# EAGLE design Transmitter (EAGLE 8.0.0)
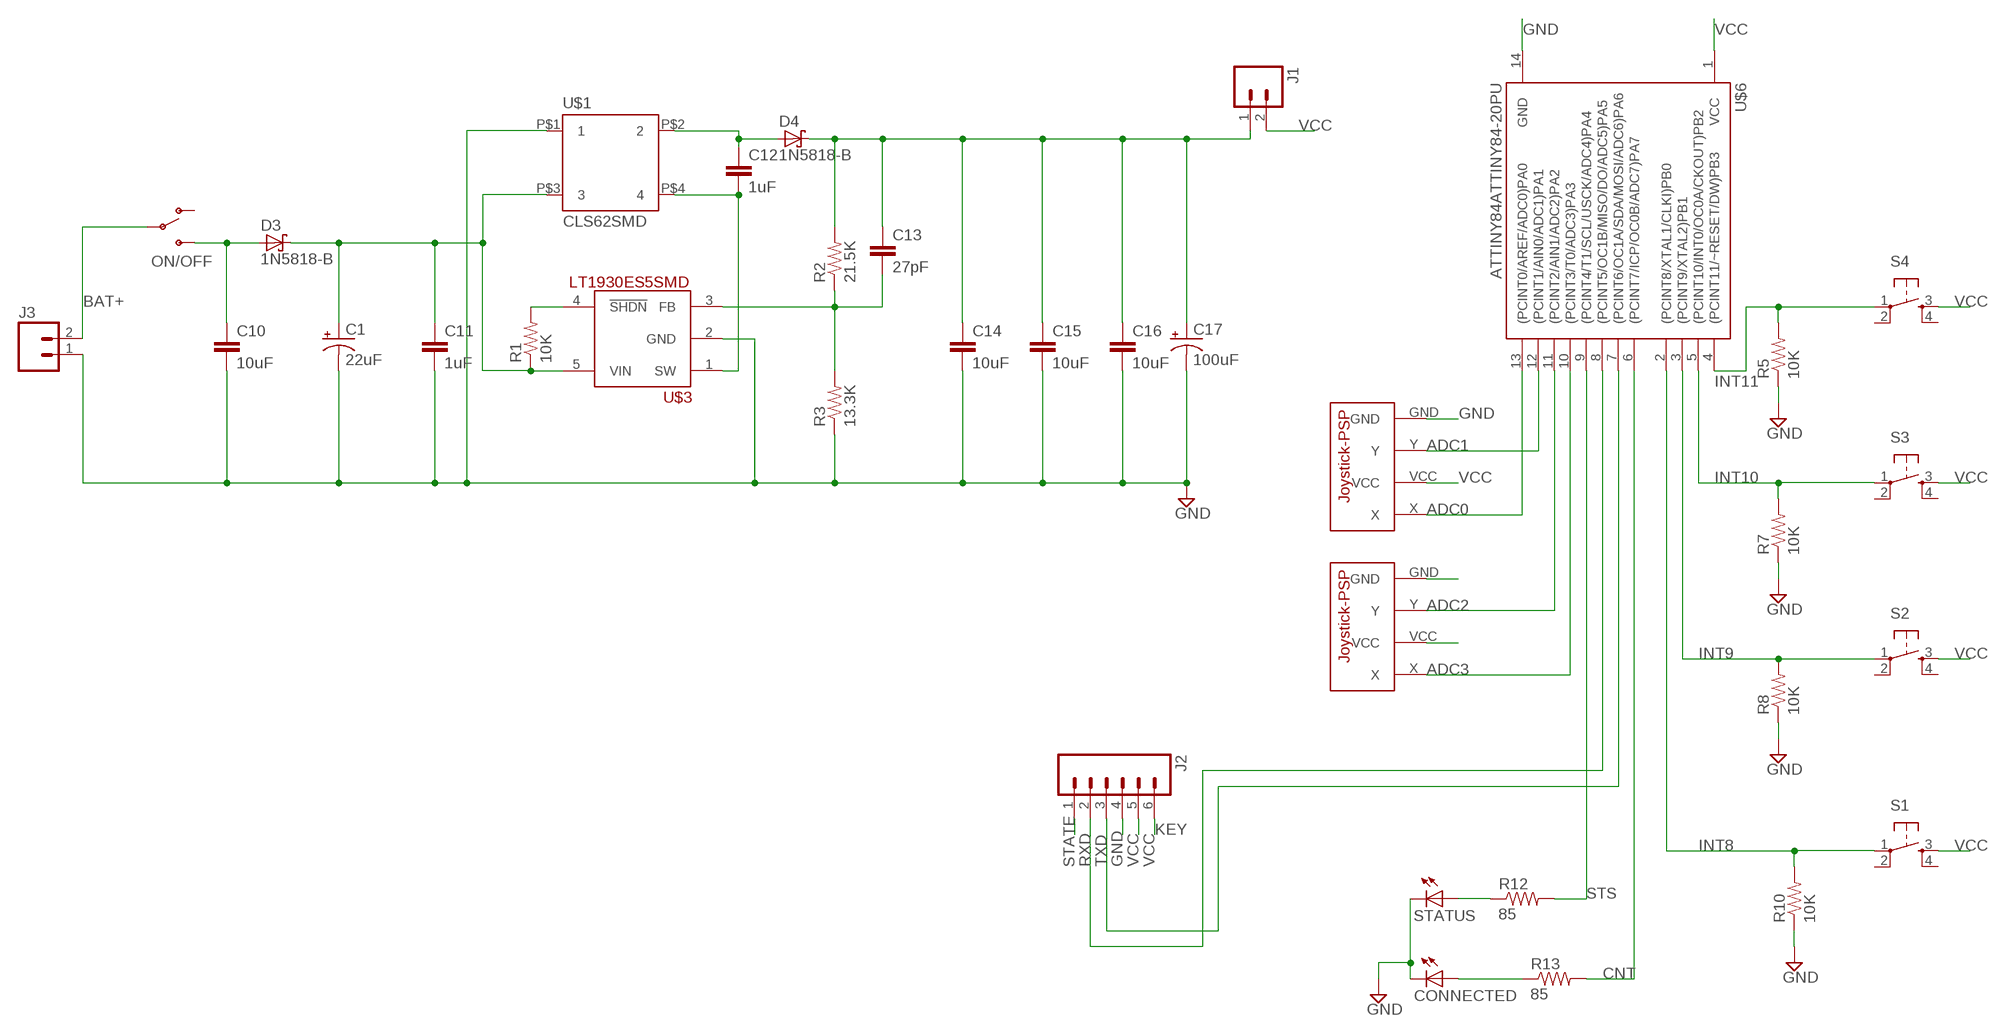
[diagram p0: schematic, sheet 1]

## Parts
C1  22uF  CAP_POLPTH2  [CPOL-RADIAL-10UF-25V]
C10  10uF  CAPEZ  [CAP-PTH-SMALLEZ]
C11  1uF  CAPEZ  [CAP-PTH-SMALLEZ]
C12  1uF  CAPEZ  [CAP-PTH-SMALLEZ]
C13  27pF  CAPEZ  [CAP-PTH-SMALLEZ]
C14  10uF  CAPEZ  [CAP-PTH-SMALLEZ]
C15  10uF  CAPEZ  [CAP-PTH-SMALLEZ]
C16  10uF  CAPEZ  [CAP-PTH-SMALLEZ]
C17  100uF  CAP_POLPTH2  [CPOL-RADIAL-10UF-25V]
CONNECTED  LED5MM  [LED5MM]
D3  1N5818-B  [DO41-7.6]
D4  1N5818-B  [DO41-7.6]
J1  M02PTH  [1X02]
J2  M06NO_SILK_FEMALE_PTH  [1X06_NO_SILK]
J3  M021X02_NO_SILK  [1X02_NO_SILK]
ON/OFF  SWITCH-SPDTKIT  [SWITCH-SPDT_KIT]
R1  10K  RESISTORPTH-1/4W  [AXIAL-0.4]
R2  21.5K  RESISTORPTH-1/4W  [AXIAL-0.4]
R3  13.3K  RESISTORPTH-1/4W  [AXIAL-0.4]
R5  10K  RESISTORPTH-1/4W  [AXIAL-0.4]
R7  10K  RESISTORPTH-1/4W  [AXIAL-0.4]
R8  10K  RESISTORPTH-1/4W  [AXIAL-0.4]
R10  10K  RESISTORPTH-1/4W  [AXIAL-0.4]
R12  85  RESISTORPTH-1/4W  [AXIAL-0.4]
R13  85  RESISTORPTH-1/4W  [AXIAL-0.4]
S1  TAC_SWITCHPTH  [TACTILE-PTH]
S2  TAC_SWITCHPTH  [TACTILE-PTH]
S3  TAC_SWITCHPTH  [TACTILE-PTH]
S4  TAC_SWITCHPTH  [TACTILE-PTH]
STATUS  LED5MM  [LED5MM]
U$1  CLS62SMD  [CLS62]
U$2  JOYSTICK-PSP1000  [JOYSTICK-PSP1000]
U$3  LT1930ES5SMD  [LT1930ES5]
U$5  JOYSTICK-PSP1000  [JOYSTICK-PSP1000]
U$6  ATTINY84ATTINY84-20PU  [DIL14]

## Nets
ADC0: U$2.X U$6.13((PCINT0/AREF/ADC0)PA0)
ADC1: U$2.Y U$6.12((PCINT1/AIN0/ADC1)PA1)
ADC2: U$5.Y U$6.11((PCINT2/AIN1/ADC2)PA2)
ADC3: U$5.X U$6.10((PCINT3/T0/ADC3)PA3)
BAT+: J3.2 ON/OFF.2(P)
CNT: R13.P$2 U$6.6((PCINT7/ICP/OC0B/ADC7)PA7)
GND: C1.2(-) C10.2 C11.2 C14.2 C15.2 C16.2 C17.2(-) CONNECTED.K(C) J2.4 J3.1 R3.P$1 R5.P$1 R7.P$1 R8.P$1 R10.P$1 STATUS.K(C) U$1.P$1 U$2.GND U$3.2(GND) U$5.GND U$6.14(GND)
INT8: R10.P$2 S1.1 U$6.2((PCINT8/XTAL1/CLKI)PB0)
INT9: R8.P$2 S2.1 U$6.3((PCINT9/XTAL2)PB1)
INT10: R7.P$2 S3.1 U$6.5((PCINT10/INT0/OC0A/CKOUT)PB2)
INT11: R5.P$2 S4.1 U$6.4((PCINT11/~RESET/DW)PB3)
N$9: C10.1 D3.A ON/OFF.3(S)
N$10: C1.1(+) C11.1 D3.C R1.P$1 U$1.P$3 U$3.5(VIN)
N$12: C12.1 D4.A U$1.P$2
N$13: C12.2 U$1.P$4 U$3.1(SW)
N$14: R1.P$2 U$3.4(!SHDN)
N$15: C13.2 R2.P$1 R3.P$2 U$3.3(FB)
N$17: C13.1 C14.1 C15.1 C16.1 C17.1(+) D4.C J1.1 R2.P$2
N$24: R12.P$1 STATUS.A
N$25: CONNECTED.A R13.P$1
RXD: J2.2 U$6.8((PCINT5/OC1B/MISO/DO/ADC5)PA5)
STATE: J2.1
STS: R12.P$2 U$6.9((PCINT4/T1/SCL/USCK/ADC4)PA4)
TXD: J2.3 U$6.7((PCINT6/OC1A/SDA/MOSI/ADC6)PA6)
VCC: J1.2 J2.5 J2.6 S1.3 S2.3 S3.3 S4.3 U$2.VCC U$5.VCC U$6.1(VCC)
Unconnected: ON/OFF.1(O) S1.2 S1.4 S2.2 S2.4 S3.2 S3.4 S4.2 S4.4

## Notes on the sheet
- KEY

## Library data of the parts
C1 = SparkFun-Passives:CAP_POL: Capacitor Polarized These are standard SMD and PTH capacitors. Normally 10uF, 47uF, and 100uF in electrolytic and tantalum varieties. Always verify the external diameter of the through hole cap, it varies with capacity, voltage, and manufacturer. The EIA devices should be standard.; MF: FARNELL; MPN: MKS2B042201F00KSSD; OC_NEWARK: 10WX4288
C10-C16 = SparkFun-Passives:CAP: Capacitor Standard 0603 ceramic capacitor, and 0.1" leaded capacitor.; OC_NEWARK: unknown
C17 = SparkFun-Passives:CAP_POL: Capacitor Polarized These are standard SMD and PTH capacitors. Normally 10uF, 47uF, and 100uF in electrolytic and tantalum varieties. Always verify the external diameter of the through hole cap, it varies with capacity, voltage, and manufacturer. The EIA devices should be standard.; OC_NEWARK: unknown
CONNECTED STATUS = led:LED: LED OSRAM: - CHIPLED LG R971, LG N971, LY N971, LG Q971, LY Q971, LO R971, LY R971 LH N974, LH R974 LS Q976, LO Q976, LY Q976 LO Q996 - Hyper CHIPLED LW Q18S LB Q993, LB Q99A, LB R99A - SideLED LS A670, LO A670, LY A670, LG A670, LP A670 LB A673, LV A673, LT A673, LW A673 LH A674 LY A675 LS A676, LA A676, LO A676, LY A676, LW A676 LS A679, LY A679, LG A679 - Hyper Micro SIDELED® LS Y876, LA Y876, LO Y876, LY Y876 LT Y87S - SmartLED LW L88C, LW L88S LB L89C, LB L89S, LG L890 LS L89K, LO L89K, LY L89K LS L896, LA L896, LO L896, LY L896 - TOPLED LS T670, LO T670, LY T670, LG T670, LP T670 LSG T670, LSP T670, LSY T670, LOP T670, LYG T670 LG T671, LOG T671, LSG T671 LB T673, LV T673, LT T673, LW T673 LH T674 LS T676, LA T676, LO T676, LY T676, LB T676, LH T676, LSB T676, LW T676 LB T67C, LV T67C, LT T67C, LS T67K, LO T67K, LY T67K, LW E67C LS E67B, LA E67B, LO E67B, LY E67B, LB E67C, LV E67C, LT E67C LW T67C LS T679, LY T679, LG T679 LS T770, LO T770, LY T770, LG T770, LP T770 LB T773, LV T773, LT T773, LW T773 LH T774 LS E675, LA E675, LY E675, LS T675 LS T776, LA T776, LO T776, LY T776, LB T776 LHGB T686 LT T68C, LB T68C - Hyper Mini TOPLED® LB M676 - Mini TOPLED Santana® LG M470 LS M47K, LO M47K, LY M47K Source: http://www.osram.convergy.de LUXEON: - LUMILED® LXK2-PW12-R00, LXK2-PW12-S00, LXK2-PW14-U00, LXK2-PW14-V00 LXK2-PM12-R00, LXK2-PM12-S00, LXK2-PM14-U00 LXK2-PE12-Q00, LXK2-PE12-R00, LXK2-PE12-S00, LXK2-PE14-T00, LXK2-PE14-U00 LXK2-PB12-K00, LXK2-PB12-L00, LXK2-PB12-M00, LXK2-PB14-N00, LXK2-PB14-P00, LXK2-PB14-Q00 LXK2-PR12-L00, LXK2-PR12-M00, LXK2-PR14-Q00, LXK2-PR14-R00 LXK2-PD12-Q00, LXK2-PD12-R00, LXK2-PD12-S00 LXK2-PH12-R00, LXK2-PH12-S00 LXK2-PL12-P00, LXK2-PL12-Q00, LXK2-PL12-R00 Source: www.luxeon.com KINGBRIGHT: KA-3528ASYC Source: www.kingbright.com; OC_NEWARK: unknown
D3 D4 = diode:1N581*: 1.0A SCHOTTKY BARRIER RECTIFIER Source: http://www.diodes.com/datasheets/ds23001.pdf; OC_NEWARK: unknown
J1 J3 = SparkFun-Connectors:M02: Standard 2-pin 0.1" header. Use with - straight break away headers ( PRT-00116) - right angle break away headers (PRT-00553) - swiss pins (PRT-00743) - machine pins (PRT-00117) - female headers (PRT-00115) Molex polarized connector foot print use with: PRT-08233 with associated crimp pins and housings. 2.54_SCREWTERM for use with PRT-10571. 3.5mm Screw Terminal footprints for PRT-08084 5mm Screw Terminal footprints for use with PRT-08432; OC_NEWARK: unknown
J2 = SparkFun-Connectors:M06: Header 6 Standard 6-pin 0.1" header. Use with straight break away headers (SKU : PRT-00116), right angle break away headers (PRT-00553), swiss pins (PRT-00743), machine pins (PRT-00117), and female headers (PRT-00115). Molex polarized connector foot print use with SKU : PRT-08094 with associated crimp pins and housings. NOTES ON THE VARIANTS LOCK and LOCK_LONGPADS... This footprint was designed to help hold the alignment of a through-hole component (i.e. 6-pin header) while soldering it into place. You may notice that each hole has been shifted either up or down by 0.005 of an inch from it's more standard position (which is a perfectly straight line). This slight alteration caused the pins (the squares in the middle) to touch the edges of the holes. Because they are alternating, it causes a "brace" to hold the component in place. 0.005 has proven to be the perfect amount of "off-center" position when using our standard breakaway headers. Although looks a little odd when you look at the bare footprint, once you have a header in there, the alteration is very hard to notice. Also,if you push a header all the way into place, it is covered up entirely on the bottom side. This idea of altering the position of holes to aid alignment will be further integrated into the Sparkfun Library for other footprints. It can help hold any component with 3 or more connection pins.; OC_NEWARK: unknown; PROD_ID: CONN-08437
ON/OFF = SparkFun-Electromechanical:SWITCH-SPDT: SPDT Switch Simple slide switch, Spark Fun Electronics SKU : COM-00102 DPDT SMT slide switch, AYZ0202, SWCH-08179; OC_NEWARK: unknown; PROD_ID: SWCH-08261
R1-R3 = SparkFun-Resistors:RESISTOR: Resistor Basic schematic elements and footprints for 0603, 1206, and PTH resistors.; OC_NEWARK: unknown
R5 R7 R8 R10 R12 R13 = SparkFun-Passives:RESISTOR: Resistor Basic schematic elements and footprints for 0603, 1206, and PTH resistors.; OC_NEWARK: unknown
S1-S4 = SparkFun-Retired:TAC_SWITCH: Momentary Switch Button commonly used for reset or general input. Spark Fun Electronics SKU : COM-00097 SMT- SWCH-08247; OC_NEWARK: unknown
U$1 = Custom:CLS62; OC_NEWARK: unknown
U$2 U$5 = SparkFun-Electromechanical:JOYSTICK-PSP1000: This is a footprint for the PSP-1000 Joystick. 4-pins: X, Y, Vcc and GND; OC_NEWARK: unknown
U$3 = linear:LT1930ES5; OC_NEWARK: unknown
U$6 = SparkFun-DigitalIC:ATTINY84: Atmel 14-pin 2/4/8kB flash uC; OC_NEWARK: unknown

## Board
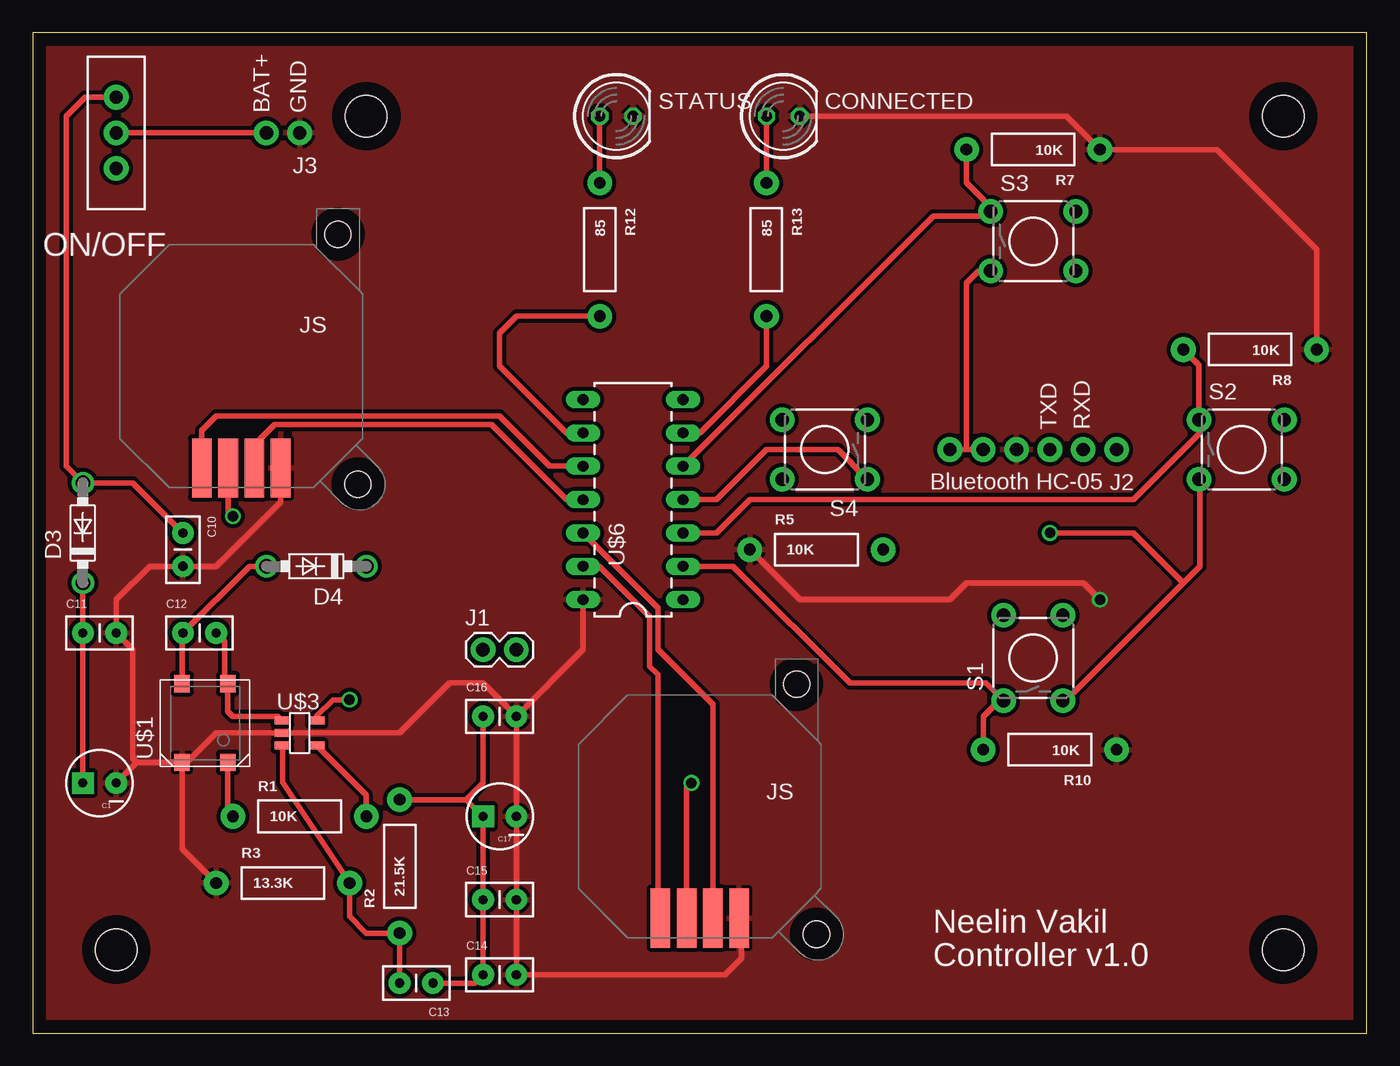
[diagram p1: board, top side]
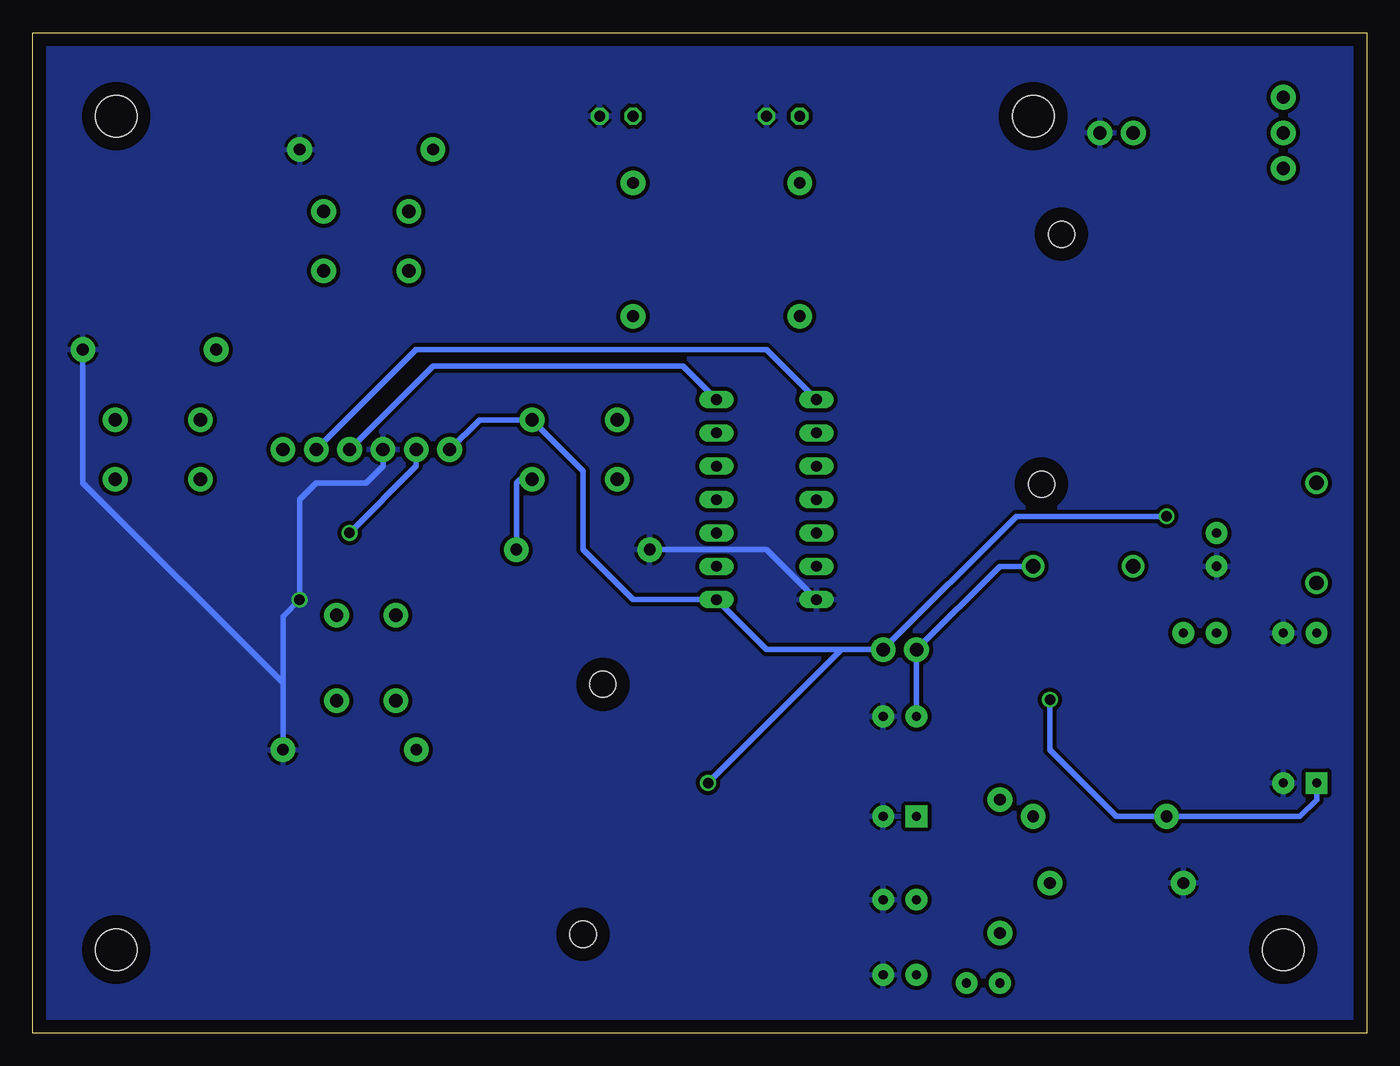
[diagram p2: board, bottom side, seen from below]

Size 101.6 x 76.2 mm. Coordinates in mm from the lower left corner, seen from the top.
Outline: 0,0 101.6,0 101.6,76.2 0,76.2 0,0
Copper layers (1*16): Top 0.035mm / dielectric 1.5mm / Bottom 0.035mm
Design rules "default": minimum track width 10mil, minimum drill 24mil, track to track 8mil, track to pad 8mil, pad to pad 8mil, via to via 8mil, smd to smd 8mil, copper to edge 40mil, drill to drill 8mil, minimum pad ring 10mil, minimum via ring 8mil, stop-mask expansion 4mil, vias tented up to drill 0mil, thermal gap 10mil
Holes 3.17 mm at 95.25,69.85 95.25,6.35 6.35,6.35 25.4,69.85

### Footprints (pad centres in the part's own frame; a part is rotated, then mirrored left to right if it is on the bottom)
CPOL-RADIAL-10UF-25V = drill 0.7 pad 1.651 square: 1 1.27,0 | drill 0.7 pad 1.651: 2 -1.27,0
CAP-PTH-SMALLEZ = drill 0.7 pad 1.651: 1 0,0; 2 2.54,0
LED5MM = drill 0.813 octagon: A -1.27,0; K 1.27,0
DO41-7.6 = drill 1.1 pad 1.7: A 3.81,0; C -3.81,0
1X02 = drill 1.016 pad 1.88: 1 0,0; 2 2.54,0
1X06_NO_SILK = drill 1.016 pad 1.88: 1 0,0; 2 2.54,0; 3 5.08,0; 4 7.62,0; 5 10.16,0; 6 12.7,0
1X02_NO_SILK = drill 1.016 pad 1.88: 1 0,0; 2 2.54,0
SWITCH-SPDT_KIT = drill 1.016 pad 1.88: 1 0,2.718; 2 0,0; 3 0,-2.718
AXIAL-0.4 = drill 0.9 pad 1.88: P$1 -5.08,0; P$2 5.08,0
TACTILE-PTH = drill 1.016 pad 1.88: 1 -3.251,2.261; 2 3.251,2.261; 3 -3.251,-2.261; 4 3.251,-2.261
CLS62 = smd 1.3 x 1.2: P$1 0.3,5.15; P$2 6.3,5.15; P$3 0.3,1.65; P$4 6.3,1.65
JOYSTICK-PSP1000 = smd 1.5 x 4.5: GND -3,7.75; VCC 1,7.75; X 3,7.75; Y -1,7.75 | hole 2: -8.89,8.985; -7.375,-10.06
LT1930ES5 = smd 0.6 x 1.2: 1 -0.95,-1.306; 2 0,-1.306; 3 0.95,-1.306; 4 0.95,1.306; 5 -0.95,1.306
DIL14 = drill 0.813 long: 1 -8.89,-3.81; 2 -6.35,-3.81; 3 -3.81,-3.81; 4 -1.27,-3.81; 5 1.27,-3.81; 6 3.81,-3.81; 7 6.35,-3.81; 8 6.35,3.81; 9 3.81,3.81; 10 1.27,3.81; 11 -1.27,3.81; 12 -3.81,3.81; 13 -6.35,3.81; 14 -8.89,3.81

### Placement (x,y rotation side)
C1  5.08,19.05 180 top
C10  11.43,38.1 270 top
C11  3.81,30.48 0 top
C12  11.43,30.48 0 top
C13  30.48,3.81 180 top
C14  34.29,4.45 0 top
C15  34.29,10.16 0 top
C16  34.29,24.13 0 top
C17  35.56,16.51 180 top
CONNECTED  57.15,69.85 0 top
D3  3.81,38.1 90 top
D4  21.59,35.56 180 top
J1  34.29,29.21 0 top
J2  82.55,44.45 180 top
J3  20.32,68.58 180 top
ON/OFF  6.35,68.58 180 top
R1  20.32,16.51 0 top
R2  27.94,12.7 90 top
R3  19.05,11.43 0 top
R5  59.69,36.83 0 top
R7  76.2,67.31 180 top
R8  92.71,52.07 180 top
R10  77.47,21.59 180 top
R12  43.18,59.69 270 top
R13  55.88,59.69 270 top
S1  76.2,28.57 90 top
S2  92.08,44.45 0 top
S3  76.2,60.33 0 top
S4  60.33,44.45 180 top
STATUS  44.45,69.85 0 top
U$1  16.51,20.32 90 top
U$2  50.8,16.51 180 top
U$3  20.32,22.86 270 top
U$5  15.88,50.8 180 top
U$6  45.72,41.91 90 top

### Tracks (layer width: path | path; a pad name or v marks a point on that pad's centre or on a via)
ADC0
  Top 0.406: U$6.13 43.18,35.56 46.99,31.75 46.99,27.94 47.62,27.3 47.62,8.94 U$2.X
ADC1
  Top 0.406: U$2.Y 51.8,25.04 47.62,29.21 47.62,32.38 U$6.12
ADC2
  Top 0.406: U$6.11 40.64,40.64 34.92,46.35 18.41,46.35 16.51,44.45 16.51,43.41 U$5.Y
ADC3
  Top 0.406: U$5.X 12.88,45.9 13.97,46.99 35.56,46.99 39.37,43.18 U$6.10
BAT+
  Top 0.406: ON/OFF.2 J3.2
CNT
  Top 0.406: U$6.6 50.8,45.72 55.88,50.8 R13.P$2
GND  (via drill 0.8)
  Top 0.406: CONNECTED.K 78.74,69.85 R7.P$1 90.17,67.31 97.79,59.69 R8.P$1 | C16.2 C17.2 C15.2 C14.2 52.7,4.45 53.98,5.71 53.98,8.59 U$2.GND | C16.2 41.91,29.21 U$6.14 | U$1.P$1 11.73,20.62 13.97,22.86 U$3.2 27.94,22.86 31.75,26.67 34.29,26.67 C16.2 | U$1.P$1 11.36,14.04 R3.P$1 | 7.92,20.62 U$1.P$1 | 7.92,20.62 C1.2 | 7.92,20.62 7.62,20.92 7.62,29.21 C11.2 6.35,33.02 8.89,35.56 C10.2 13.97,35.56 18.88,40.47 U$5.GND | R5.P$1 58.42,33.02 69.85,33.02 71.12,34.29 80.01,34.29 v81.28,33.02
  Bottom 0.406: R5.P$1 45.72,36.83 U$6.14 | 82.55,26.67 82.55,31.75 v81.28,33.02 81.28,40.64 80.01,41.91 76.2,41.91 74.93,43.18 J2.4 | 82.55,26.67 R10.P$1 | R8.P$1 97.79,41.91 82.55,26.67
  pour Top (isolate 0.305): 0,0 101.6,0 101.6,76.2 0,76.2
  pour Bottom (isolate 0.305): 0,0 101.6,0 101.6,76.2 0,76.2
INT8
  Top 0.406: U$6.2 53.34,35.56 62.23,26.67 72.59,26.67 S1.1 73.58,25.32 72.39,24.13 R10.P$2
INT9
  Top 0.406: R8.P$2 88.82,50.88 S2.1 88.82,45.64 83.82,40.64 54.61,40.64 52.07,38.1 U$6.3
INT10
  Top 0.406: U$6.5 68.58,62.23 72.59,62.23 S3.1 72.95,62.94 71.12,64.77 R7.P$2
INT11
  Top 0.406: U$6.4 52.07,40.64 55.88,44.45 61.32,44.45 S4.1
  Bottom 0.406: S4.1 64.49,42.19 64.77,41.91 R5.P$2
N$9
  Top 0.406: C10.1 7.62,41.91 D3.A 2.54,43.18 2.54,69.85 3.99,71.3 ON/OFF.3
N$10  (via drill 0.8)
  Top 0.406: U$1.P$3 14.86,16.89 R1.P$1 | U$3.5 21.63,24.17 22.86,25.4 v24.13,25.4 | C1.1 C11.1 D3.C
  Bottom 0.406: v24.13,25.4 24.13,21.59 19.05,16.51 R1.P$1 5.08,16.51 3.81,17.78 C1.1
N$12
  Top 0.406: U$1.P$2 11.36,30.41 C12.1 16.51,35.56 D4.A
N$13
  Top 0.406: U$3.1 18.69,24.13 15.24,24.13 14.86,24.51 U$1.P$4 14.61,26.88 14.61,29.84 C12.2
N$14
  Top 0.406: R1.P$2 25.4,18.14 U$3.4
N$15
  Top 0.406: C13.2 R2.P$1 25.4,7.62 24.13,8.89 R3.P$2 19.01,19.09 U$3.3
N$17
  Top 0.406: C13.1 33.66,3.81 C14.1 C15.1 C17.1 33.02,17.78 | 33.02,17.78 R2.P$2 | C16.1 34.29,19.05 33.02,17.78
  Bottom 0.406: C16.1 J1.1 27.94,35.56 D4.C
N$24
  Top 0.406: R12.P$1 STATUS.A
N$25
  Top 0.406: R13.P$1 CONNECTED.A
RXD
  Bottom 0.406: J2.2 72.39,52.07 45.72,52.07 U$6.8
STS
  Top 0.406: U$6.9 40.64,45.72 35.56,50.8 35.56,53.34 36.83,54.61 R12.P$2
TXD
  Bottom 0.406: U$6.7 52.07,50.8 71.12,50.8 J2.3
VCC  (via drill 0.8)
  Top 0.406: 71.12,44.45 J2.6 | 71.12,44.45 J2.5 | S1.3 78.66,25.32 87.63,34.29 | 87.63,34.29 88.9,35.56 88.9,42.11 S2.3 | U$2.VCC 49.8,18.68 v50.16,19.05 | U$5.VCC 14.88,39.73 v15.24,39.37 | v77.47,38.1 83.82,38.1 87.63,34.29 | S3.3 72.03,58.06 71.12,57.15 71.12,44.45
  Bottom 0.406: 40.01,29.21 J1.2 26.67,39.37 v15.24,39.37 | 40.01,29.21 v50.16,19.05 | 40.01,29.21 45.72,29.21 U$6.1 55.88,33.02 59.69,36.83 59.69,42.82 S4.3 67.59,46.71 J2.6 | J2.5 72.39,43.18 v77.47,38.1

### Text on the board
tPlace: BAT+ | GND | JS | TXD | RXD | Bluetooth HC-05 | JS | Neelin Vakil | Controller v1.0